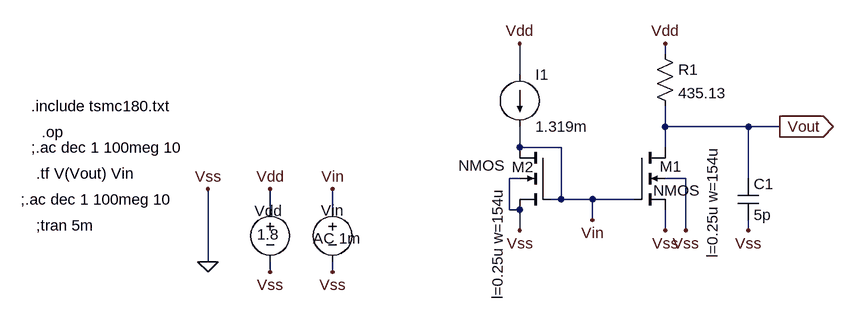
[diagram p0: schematic CS_amp_with_CurrentMirror.asc]
CS_amp_with_CurrentMirror.asc, the LTspice schematic file:
Version 4
SHEET 1 1056 680
WIRE 752 -32 752 -48
WIRE 528 0 528 -48
WIRE 752 80 752 48
WIRE 880 80 752 80
WIRE 928 80 880 80
WIRE 528 112 528 80
WIRE 592 112 528 112
WIRE 752 112 752 80
WIRE 528 160 512 160
WIRE 784 160 752 160
WIRE 880 160 880 80
WIRE 592 192 592 112
WIRE 592 192 576 192
WIRE 640 192 592 192
WIRE 704 192 640 192
WIRE 144 208 144 176
WIRE 240 208 240 176
WIRE 512 208 512 160
WIRE 528 208 512 208
WIRE 640 224 640 192
WIRE 528 240 528 208
WIRE 752 240 752 208
WIRE 784 240 784 160
WIRE 880 240 880 224
WIRE 48 288 48 176
WIRE 144 304 144 288
WIRE 240 304 240 288
FLAG 48 288 0
FLAG 48 176 Vss
FLAG 240 176 Vin
FLAG 144 304 Vss
FLAG 240 304 Vss
FLAG 144 176 Vdd
FLAG 752 -48 Vdd
FLAG 752 240 Vss
FLAG 784 240 Vss
FLAG 928 80 Vout
IOPIN 928 80 Out
FLAG 880 240 Vss
FLAG 528 240 Vss
FLAG 528 -48 Vdd
FLAG 640 224 Vin
SYMBOL nmos4 704 112 R0
WINDOW 0 40 29 Left 2
WINDOW 3 30 66 Left 2
WINDOW 123 121 -2 VRight 2
SYMATTR InstName M1
SYMATTR Value2 l=0.25u w=154u
SYMBOL voltage 144 192 R0
WINDOW 123 0 0 Left 0
WINDOW 39 0 0 Left 0
WINDOW 0 -24 18 Left 2
WINDOW 3 -20 54 Left 2
SYMATTR InstName Vdd
SYMATTR Value 1.8
SYMBOL voltage 240 192 R0
WINDOW 0 -18 17 Left 2
WINDOW 3 82 -9 VRight 2
WINDOW 123 -30 60 Left 2
WINDOW 39 0 0 Left 0
SYMATTR InstName Vin
SYMATTR Value ""
SYMATTR Value2 AC 1m
SYMBOL res 736 -48 R0
SYMATTR InstName R1
SYMATTR Value 435.13
SYMBOL cap 864 160 R0
SYMATTR InstName C1
SYMATTR Value 5p
SYMBOL nmos4 576 112 M0
WINDOW 0 26 30 Left 2
WINDOW 3 70 28 Left 2
WINDOW 123 82 234 VLeft 2
SYMATTR InstName M2
SYMATTR Value2 l=0.25u w=154u
SYMBOL current 528 0 R0
WINDOW 123 0 0 Left 0
WINDOW 39 0 0 Left 0
SYMATTR InstName I1
SYMATTR Value 1.319m
TEXT -224 48 Left 2 !.include tsmc180.txt
TEXT -208 88 Left 2 !.op
TEXT -224 112 Left 2 !;.ac dec 1 100meg 10
TEXT -216 152 Left 2 !.tf V(Vout) Vin
TEXT -240 192 Left 2 !;.ac dec 1 100meg 10
TEXT -216 232 Left 2 !;tran 5m

The netlist it stands for:
* CS_amp_with_CurrentMirror.asc
M1 Vout Vin 0 0 NMOS l=0.25u w=154u
Vdd Vdd 0 1.8
Vin Vin 0 AC 1m
R1 Vdd Vout 435.13
C1 Vout 0 5p
M2 Vin Vin 0 0 NMOS l=0.25u w=154u
I1 Vdd Vin 1.319m
.model NMOS NMOS
.model PMOS PMOS
.lib standard.mos
.include tsmc180.txt
.op
;.ac dec 1 100meg 10
.tf V(Vout) Vin
;.ac dec 1 100meg 10
;tran 5m
.backanno
.end